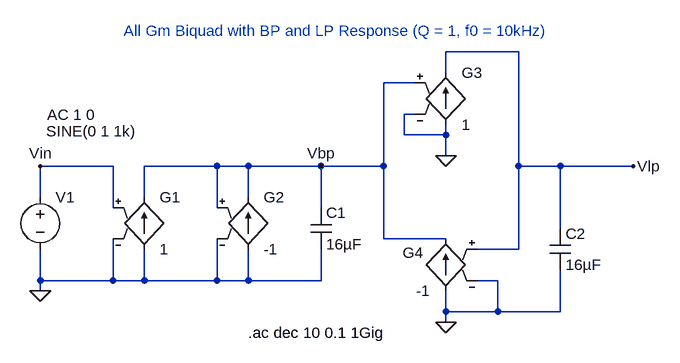
[diagram p0: schematic AllGmBiquad.asc]
AllGmBiquad.asc, the LTspice schematic file:
Version 4
SHEET 1 880 680
WIRE 96 48 -16 48
WIRE -16 80 -16 48
WIRE -64 96 -112 96
WIRE -64 144 -80 144
WIRE -80 176 -80 144
WIRE -16 176 -16 160
WIRE -16 176 -80 176
WIRE -16 208 -16 176
WIRE -528 224 -640 224
WIRE -368 224 -480 224
WIRE -320 224 -368 224
WIRE -208 224 -320 224
WIRE -112 224 -112 96
WIRE -112 224 -208 224
WIRE 96 224 96 48
WIRE 160 224 96 224
WIRE 272 224 160 224
WIRE -640 272 -640 224
WIRE -480 272 -480 224
WIRE -320 272 -320 224
WIRE -528 288 -528 224
WIRE -368 288 -368 224
WIRE -208 288 -208 224
WIRE 160 320 160 224
WIRE -112 336 -112 224
WIRE -16 336 -112 336
WIRE 96 352 96 224
WIRE 96 352 32 352
WIRE -640 400 -640 352
WIRE -528 400 -528 336
WIRE -528 400 -640 400
WIRE -480 400 -480 352
WIRE -480 400 -528 400
WIRE -368 400 -368 336
WIRE -368 400 -480 400
WIRE -320 400 -320 352
WIRE -320 400 -368 400
WIRE -208 400 -208 352
WIRE -208 400 -320 400
WIRE 64 400 32 400
WIRE -640 416 -640 400
WIRE -16 448 -16 416
WIRE 64 448 64 400
WIRE 64 448 -16 448
WIRE 160 448 160 384
WIRE 160 448 64 448
WIRE -16 464 -16 448
FLAG -640 416 0
FLAG -16 208 0
FLAG -16 464 0
FLAG -208 224 Vbp
FLAG 272 224 Vlp
FLAG -640 224 Vin
SYMBOL voltage -640 256 R0
WINDOW 3 9 -86 Left 2
WINDOW 123 11 -111 Left 2
WINDOW 39 0 0 Left 0
SYMATTR InstName V1
SYMATTR Value SINE(0 1 1k)
SYMATTR Value2 AC 1 0
SYMBOL g -480 256 R0
SYMATTR InstName G1
SYMATTR Value 1
SYMBOL g -320 256 R0
SYMATTR InstName G2
SYMATTR Value -1
SYMBOL cap -224 288 R0
SYMATTR InstName C1
SYMATTR Value 16µF
SYMBOL g -16 64 R0
SYMATTR InstName G3
SYMATTR Value 1
SYMBOL g -16 320 M0
WINDOW 0 34 37 Left 2
SYMATTR InstName G4
SYMATTR Value -1
SYMBOL cap 144 320 R0
SYMATTR InstName C2
SYMATTR Value 16µF
TEXT -512 16 Left 2 ;All Gm Biquad with BP and LP Response (Q = 1, f0 = 10kHz)
TEXT -320 480 Left 2 !.ac dec 10 0.1 1Gig

The netlist it stands for:
* AllGmBiquad.asc
V1 Vin 0 SINE(0 1 1k) AC 1 0
G1 0 Vbp Vin 0 1
G2 0 Vbp Vbp 0 -1
C1 Vbp 0 16µF
G3 0 Vlp Vbp 0 1
G4 0 Vbp Vlp 0 -1
C2 Vlp 0 16µF
* All Gm Biquad with BP and LP Response (Q = 1, f0 = 10kHz)
.ac dec 10 0.1 1Gig
.backanno
.end